# EAGLE schematic BMSBoard (EAGLE 9.6.2)
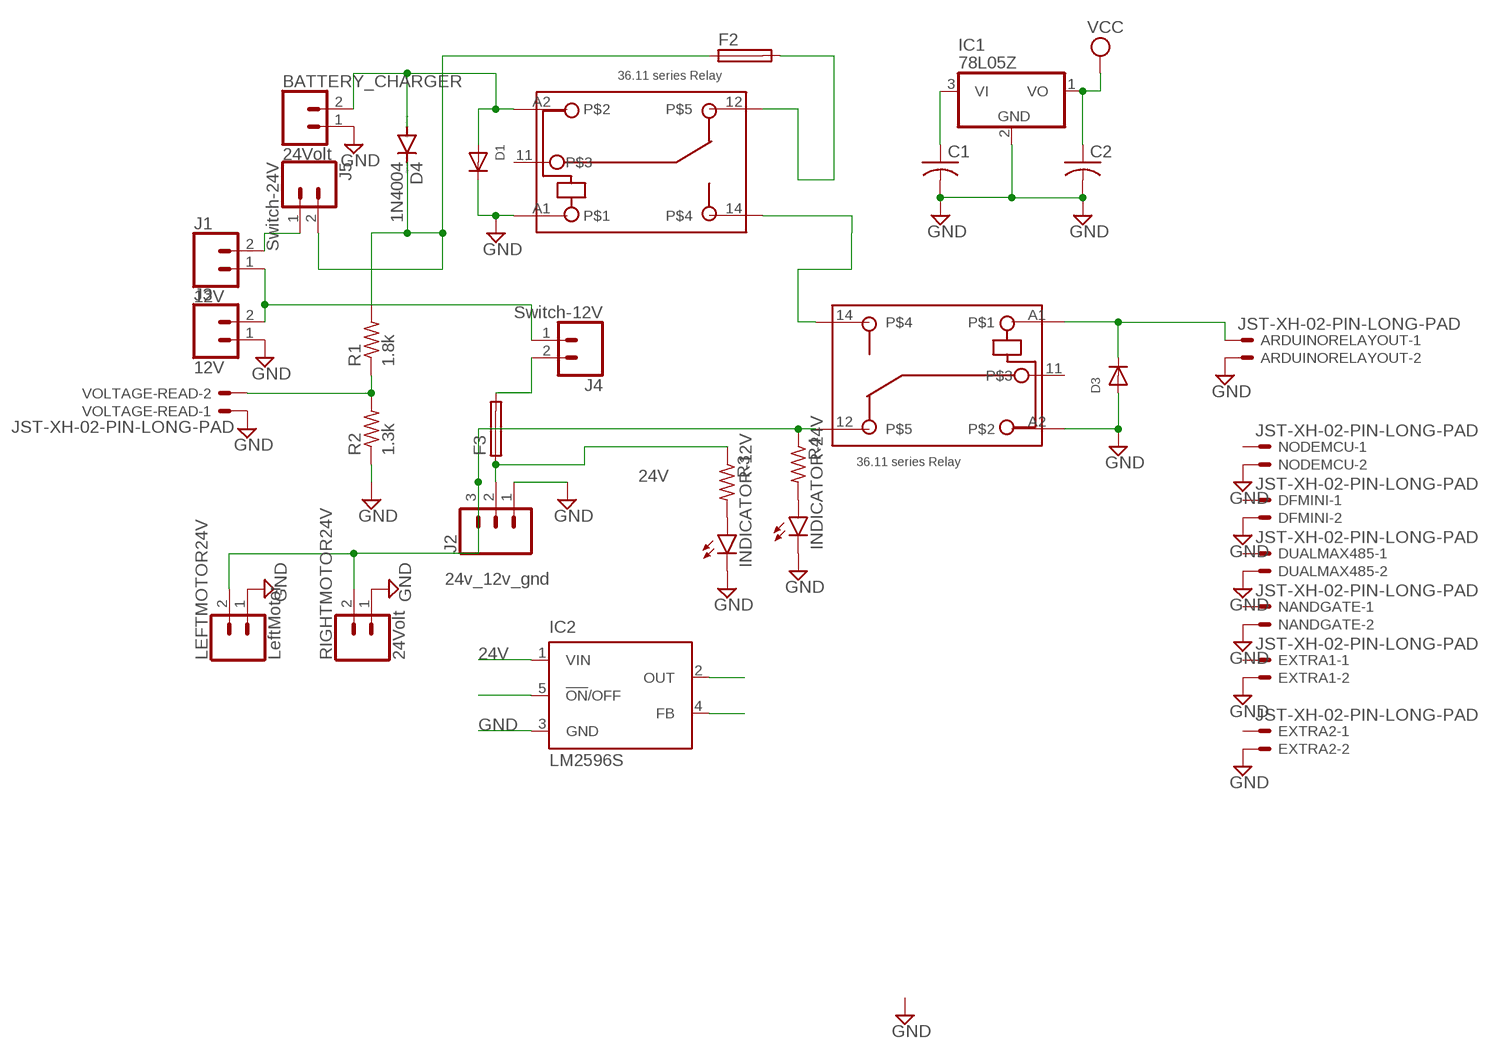
[diagram p0: schematic, sheet 1]

## Parts
ARDUINORELAYOUT  JST-XH-02-PIN-LONG-PAD  [JST-XH-02-PACKAGE-LONG-PAD]
BATTERY_CHARGER  24Volt  CONN_023.5MM  [SCREWTERMINAL-3.5MM-2]
BMSRELAY  36.11  [36.11]
C1  C-US025-024X044  [C025-024X044]
C2  C-US025-024X044  [C025-024X044]
CHARGERRELAY  36.11  [36.11]
D1  DIODEDO-1N4148  [DO-1N4148]
D3  DIODEDO-1N4148  [DO-1N4148]
D4  1N4004  [DO41-10]
DFMINI  JST-XH-02-PIN-LONG-PAD  [JST-XH-02-PACKAGE-LONG-PAD]
DUALMAX485  JST-XH-02-PIN-LONG-PAD  [JST-XH-02-PACKAGE-LONG-PAD]
EXTRA1  JST-XH-02-PIN-LONG-PAD  [JST-XH-02-PACKAGE-LONG-PAD]
EXTRA2  JST-XH-02-PIN-LONG-PAD  [JST-XH-02-PACKAGE-LONG-PAD]
F2  19560  [19560]
F3  19560  [19560]
IC1  78L05Z  [TO92]
IC2  LM2596S  [TO263-5]
INDICATOR-12V  LED  [SMARTLED-TTW]
INDICATOR-24V  LED  [SMARTLED-TTW]
J1  12V  CONN_023.5MM  [SCREWTERMINAL-3.5MM-2]
J2  24v_12v_gnd  CONN_03-SCREW-5MM  [SCREWTERMINAL-5MM-3]
J3  12V  CONN_023.5MM  [SCREWTERMINAL-3.5MM-2]
J4  Switch-12V  CONN_023.5MM  [SCREWTERMINAL-3.5MM-2]
J5  Switch-24V  CONN_023.5MM  [SCREWTERMINAL-3.5MM-2]
LEFTMOTOR24V  LeftMotor  CONN_023.5MM  [SCREWTERMINAL-3.5MM-2]
NANDGATE  JST-XH-02-PIN-LONG-PAD  [JST-XH-02-PACKAGE-LONG-PAD]
NODEMCU  JST-XH-02-PIN-LONG-PAD  [JST-XH-02-PACKAGE-LONG-PAD]
R1  1.8k  R-US_0204/7  [0204/7]
R2  1.3k  R-US_0204/7  [0204/7]
R3  R-US_0204/2V  [0204V]
R4  R-US_0204/2V  [0204V]
RIGHTMOTOR24V  24Volt  CONN_023.5MM  [SCREWTERMINAL-3.5MM-2]
VOLTAGE-READ  JST-XH-02-PIN-LONG-PAD  [JST-XH-02-PACKAGE-LONG-PAD]

## Nets
24V [New Class]: F3.1 IC2.1(VIN) J2.2 R3.1
GND: ARDUINORELAYOUT.2 BATTERY_CHARGER.1 BMSRELAY.A2 C1.2 C2.2 CHARGERRELAY.A1 D1.C D3.A DFMINI.2 DUALMAX485.2 EXTRA1.2 EXTRA2.2 IC1.2(GND) IC2.3(GND) INDICATOR-12V.C@1(C) INDICATOR-24V.C@1(C) J2.1 J3.1 LEFTMOTOR24V.1 NANDGATE.2 NODEMCU.2 R2.1 RIGHTMOTOR24V.1 VOLTAGE-READ.1
N$1: R1.1 R2.2 VOLTAGE-READ.2
N$2: BATTERY_CHARGER.2 CHARGERRELAY.A2 D1.A D4.A
N$3: CHARGERRELAY.12 F2.2
N$4: ARDUINORELAYOUT.1 BMSRELAY.A1 D3.C
N$5: D4.C F2.1 J5.2 R1.2
N$6: BMSRELAY.14 CHARGERRELAY.14
N$8: BMSRELAY.12 J2.3 LEFTMOTOR24V.2 R4.1 RIGHTMOTOR24V.2
N$9: J1.1 J3.2 J4.1
N$10: C1.1 IC1.3(VI)
N$11: J1.2 J5.1
N$12: F3.2 J4.2
N$13: IC2.5(!ON!/OFF)
N$14: INDICATOR-24V.A@1(A) R4.2
N$15: INDICATOR-12V.A@1(A) R3.2
N$17: IC2.2(OUT)
N$18: IC2.4(FB)
VCC: C2.1 IC1.1(VO)
Unconnected: BMSRELAY.11 CHARGERRELAY.11 DFMINI.1 DUALMAX485.1 EXTRA1.1 EXTRA2.1 NANDGATE.1 NODEMCU.1

## Library data of the parts
ARDUINORELAYOUT DFMINI DUALMAX485 EXTRA1 EXTRA2 NANDGATE NODEMCU VOLTAGE-READ = Rembrandt Electronics - JST XH Connectors v1-0:JST-XH-02-PIN: JST XH Connector 2 Pin Wire to board connector. Pitch: 2,54 mm, (0.100") Number of pins: 2 Created by Rembrandt Electronics www.rembrandtelectronics.com
BATTERY_CHARGER J1 J3-J5 LEFTMOTOR24V RIGHTMOTOR24V = SparkFun-Connectors:CONN_02: Multi connection point. Often used as Generic Header-pin footprint for 0.1 inch spaced/style header connections On any of the 0.1 inch spaced packages, you can populate with these: Break Away Headers - Straight <https://www.sparkfun.com/products/116> (PRT-00116) Break Away Male Headers - Right Angle <https://www.sparkfun.com/products/553> (PRT-00553) Female Headers <https://www.sparkfun.com/products/115> (PRT-00115) Break Away Headers - Machine Pin <https://www.sparkfun.com/products/117> (PRT-00117) Break Away Female Headers - Swiss Machine Pin <https://www.sparkfun.com/products/743> (PRT-00743) For SCREWTERMINALS and SPRING TERMINALS visit here: Screw Terimnals on SparkFun.com <https://www.sparkfun.com/search/results?term=Screw+Terminals> (5mm/3.5mm/2.54mm spacing) This device is also useful as a general connection point to wire up your design to another part of your project. Our various solder wires solder well into these plated through hole pads. Hook-Up Wire - Assortment (Stranded, 22 AWG) <https://www.sparkfun.com/products/11375> (PRT-11375) Hook-Up Wire - Assortment (Solid Core, 22 AWG) <https://www.sparkfun.com/products/11367> (PRT-11367) View the entire wire category on our website here <https://www.sparkfun.com/categories/141> Special notes: Molex polarized connector foot print use with: PRT-08233 with associated crimp pins and housings. 2.54_SCREWTERM for use with PRT-10571. 3.5mm Screw Terminal footprints for PRT-08084 5mm Screw Terminal footprints for use with PRT-08432; PROD_ID: CONN-08399
BMSRELAY CHARGERRELAY = relay_finder_36_11:36.11: Printed circuit mount miniature 10 A relay one pole changeover contacts Conform RoHS
C1 C2 = adafruit:C-US: CAPACITOR, American symbol
D1 D3 = adafruit:DIODE: Diode SMADIODE - SMA Surface Mount Package 20V 1A Schottky Diode Digikey: 641-1014-6-ND DO-1N4148 - Through Hole Small Current Diode SOD-123 20V 1 A (.5mV Vf) Schottky Diode - Digikey: MBRX120TPMSCT-ND SOD-323 10V 570mA (.38mV Vf, 3ns) Schottky Diode - Digikey: ZLLS410CT-ND SOD-523 30V 30mA Schottky Diode (RB751S-40TE61) - Digikey: RB751S-40TE61CT-ND SOT23-R/W - SOT23 Package (R = Solder Paste/Reflow Ovens, W = Hand-Soldering) BAT54Film 40V 300mA - Digikey: 497-7162-1-ND
D4 = diode:1N4004: DIODE general purpose rectifier, 1 A
F2 F3 = fuse:19560: FUSE HOLDER TR5, Wickmann; MPN: 56000001009; OC_FARNELL: 1185363; OC_NEWARK: 15P8392
IC1 = adafruit:78*: Positive VOLTAGE REGULATOR Added bigger pads to the TO-92 package
IC2 = national-semiconductor:LM2596: SIMPLE SWITCHER® Power Converter 150 kHz 3A Step-Down Voltage Regulator Source: http://www.national.com/ds/LM/LM2596.pdf; MF: NATIONAL SEMICONDUCTOR; MPN: LM2596S-ADJ/NOPB; OC_FARNELL: 9494367; OC_NEWARK: 41K3842
INDICATOR-12V INDICATOR-24V = led:LED: LED OSRAM: - CHIPLED LG R971, LG N971, LY N971, LG Q971, LY Q971, LO R971, LY R971 LH N974, LH R974 LS Q976, LO Q976, LY Q976 LO Q996 - Hyper CHIPLED LW Q18S LB Q993, LB Q99A, LB R99A - SideLED LS A670, LO A670, LY A670, LG A670, LP A670 LB A673, LV A673, LT A673, LW A673 LH A674 LY A675 LS A676, LA A676, LO A676, LY A676, LW A676 LS A679, LY A679, LG A679 - Hyper Micro SIDELED® LS Y876, LA Y876, LO Y876, LY Y876 LT Y87S - SmartLED LW L88C, LW L88S LB L89C, LB L89S, LG L890 LS L89K, LO L89K, LY L89K LS L896, LA L896, LO L896, LY L896 - TOPLED LS T670, LO T670, LY T670, LG T670, LP T670 LSG T670, LSP T670, LSY T670, LOP T670, LYG T670 LG T671, LOG T671, LSG T671 LB T673, LV T673, LT T673, LW T673 LH T674 LS T676, LA T676, LO T676, LY T676, LB T676, LH T676, LSB T676, LW T676 LB T67C, LV T67C, LT T67C, LS T67K, LO T67K, LY T67K, LW E67C LS E67B, LA E67B, LO E67B, LY E67B, LB E67C, LV E67C, LT E67C LW T67C LS T679, LY T679, LG T679 LS T770, LO T770, LY T770, LG T770, LP T770 LB T773, LV T773, LT T773, LW T773 LH T774 LS E675, LA E675, LY E675, LS T675 LS T776, LA T776, LO T776, LY T776, LB T776 LHGB T686 LT T68C, LB T68C - Hyper Mini TOPLED® LB M676 - Mini TOPLED Santana® LG M470 LS M47K, LO M47K, LY M47K Source: http://www.osram.convergy.de LUXEON: - LUMILED® LXK2-PW12-R00, LXK2-PW12-S00, LXK2-PW14-U00, LXK2-PW14-V00 LXK2-PM12-R00, LXK2-PM12-S00, LXK2-PM14-U00 LXK2-PE12-Q00, LXK2-PE12-R00, LXK2-PE12-S00, LXK2-PE14-T00, LXK2-PE14-U00 LXK2-PB12-K00, LXK2-PB12-L00, LXK2-PB12-M00, LXK2-PB14-N00, LXK2-PB14-P00, LXK2-PB14-Q00 LXK2-PR12-L00, LXK2-PR12-M00, LXK2-PR14-Q00, LXK2-PR14-R00 LXK2-PD12-Q00, LXK2-PD12-R00, LXK2-PD12-S00 LXK2-PH12-R00, LXK2-PH12-S00 LXK2-PL12-P00, LXK2-PL12-Q00, LXK2-PL12-R00 Source: www.luxeon.com KINGBRIGHT: KA-3528ASYC Source: www.kingbright.com
J2 = SparkFun-Connectors:CONN_03: Multi connection point. Often used as Generic Header-pin footprint for 0.1 inch spaced/style header connections On any of the 0.1 inch spaced packages, you can populate with these: Break Away Headers - Straight <https://www.sparkfun.com/products/116> (PRT-00116) Break Away Male Headers - Right Angle <https://www.sparkfun.com/products/553> (PRT-00553) Female Headers <https://www.sparkfun.com/products/115> (PRT-00115) Break Away Headers - Machine Pin <https://www.sparkfun.com/products/117> (PRT-00117) Break Away Female Headers - Swiss Machine Pin <https://www.sparkfun.com/products/743> (PRT-00743) Stackable Header - 3 Pin (Female, 0.1") <https://www.sparkfun.com/products/13875> (PRT-13875) For SCREWTERMINALS and SPRING TERMINALS visit here: Screw Terimnals on SparkFun.com <https://www.sparkfun.com/search/results?term=Screw+Terminals> (5mm/3.5mm/2.54mm spacing) This device is also useful as a general connection point to wire up your design to another part of your project. Our various solder wires solder well into these plated through hole pads. Hook-Up Wire - Assortment (Stranded, 22 AWG) <https://www.sparkfun.com/products/11375> (PRT-11375) Hook-Up Wire - Assortment (Solid Core, 22 AWG) <https://www.sparkfun.com/products/11367> (PRT-11367) View the entire wire category on our website here <https://www.sparkfun.com/categories/141> Special notes: Molex polarized connector foot print use with SKU : PRT-08232 with associated crimp pins and housings.; PROD_ID: CONN-10134; SF_SKU: PRT-08433
R1-R4 = rcl:R-US_: RESISTOR, American symbol; SPICEPREFIX: R